# Altium schematic sheet ChannelDriver.SchDoc
size A3
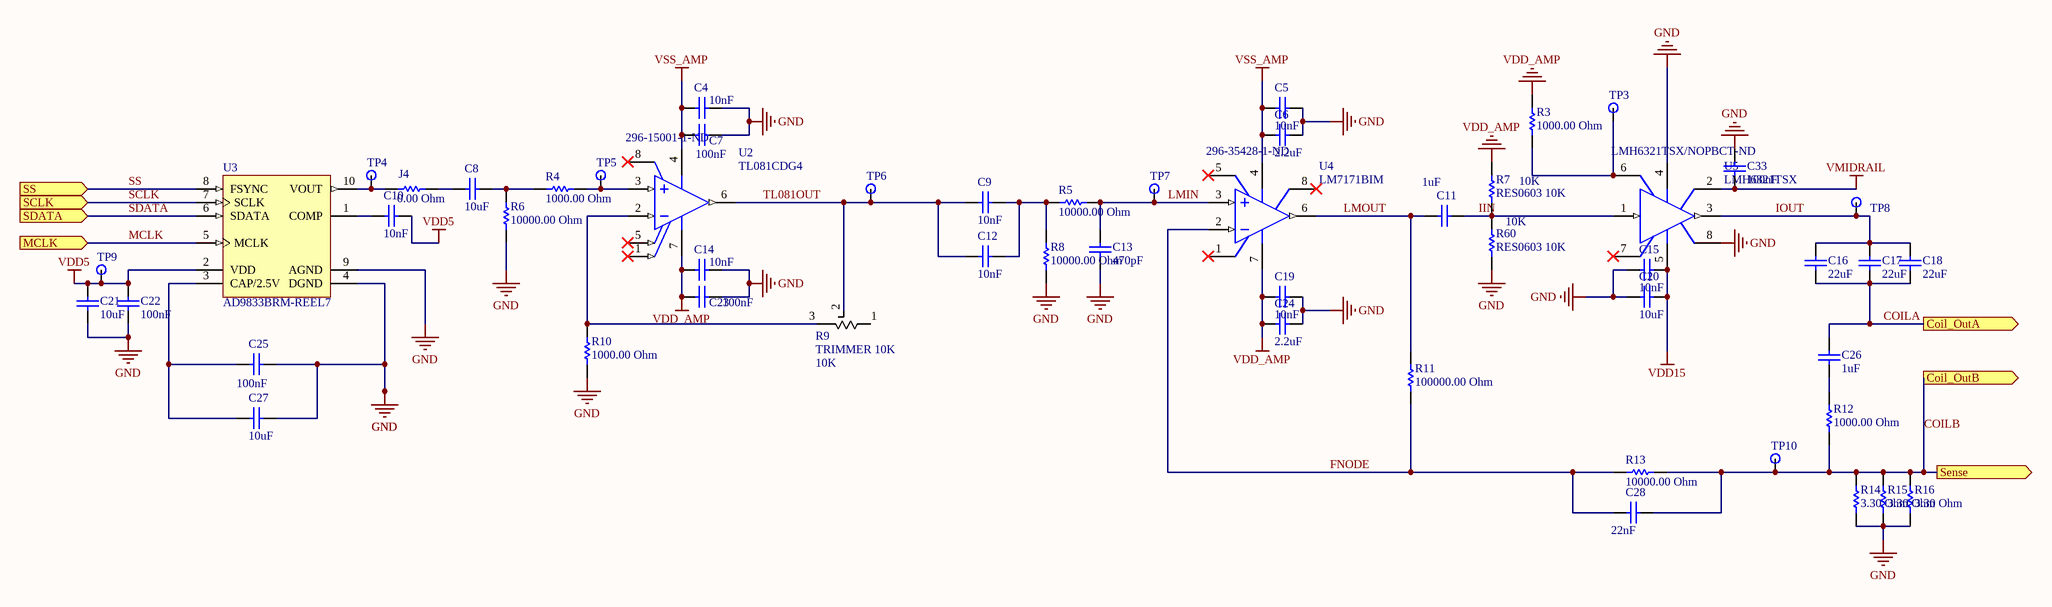
[diagram p0: ChannelDriver.SchDoc]

## Parts
C4  value 10nF  [CAPC0603(1608)100_N]  (hidden comment: CAP 10nF 25V 0603(1608))
C5  value 10nF  [CAPC0603(1608)100_N]  (hidden comment: CAP 10nF 25V 0603(1608))
C6  value 2.2uF  [CAPC0603(1608)100_M]  (hidden comment: CAP 2.2uF 25V 0603(1608))
C7  value 100nF  [CAPC0603(1608)100_M]  (hidden comment: CAP 100nF 25V 0603(1608))
C8  value 10uF  [CAPC1206(3216)190_L]  (hidden comment: CAP 10uF 25V 1206(3216))
C9  value 10nF  [CAPC0603(1608)100_N]  (hidden comment: CAP 10nF 25V 0603(1608))
C10  value 10nF  [CAPC0603(1608)100_N]  (hidden comment: CAP 10nF 25V 0603(1608))
C11  value 1uF  [CAPC0603(1608)100_L]  (hidden comment: CAP 1uF 25V 0603(1608))
C12  value 10nF  [CAPC0603(1608)100_N]  (hidden comment: CAP 10nF 25V 0603(1608))
C13  value 470pF  [CAPC0603(1608)100_N]  (hidden comment: CAP 470pF 25V 0603(1608))
C14  value 10nF  [CAPC0603(1608)100_N]  (hidden comment: CAP 10nF 25V 0603(1608))
C15  value 10nF  [CAPC0603(1608)100_N]  (hidden comment: CAP 10nF 25V 0603(1608))
C16  value 22uF  [CAPC1206(3216)190_M]  (hidden comment: CAP 22uF 25V 1206(3216))
C17  value 22uF  [CAPC1206(3216)190_M]  (hidden comment: CAP 22uF 25V 1206(3216))
C18  value 22uF  [CAPC1206(3216)190_M]  (hidden comment: CAP 22uF 25V 1206(3216))
C19  value 10nF  [CAPC0603(1608)100_N]  (hidden comment: CAP 10nF 25V 0603(1608))
C20  value 10uF  [CAPC1206(3216)190_L]  (hidden comment: CAP 10uF 25V 1206(3216))
C21  value 10uF  [CAPC1206(3216)190_L]  (hidden comment: CAP 10uF 25V 1206(3216))
C22  value 100nF  [CAPC0603(1608)100_M]  (hidden comment: CAP 100nF 25V 0603(1608))
C23  value 100nF  [CAPC0603(1608)100_M]  (hidden comment: CAP 100nF 25V 0603(1608))
C24  value 2.2uF  [CAPC0603(1608)100_M]  (hidden comment: CAP 2.2uF 25V 0603(1608))
C25  value 100nF  [CAPC0603(1608)100_M]  (hidden comment: CAP 100nF 25V 0603(1608))
C26  value 1uF  [CAPC0603(1608)100_L]  (hidden comment: CAP 1uF 25V 0603(1608))
C27  value 10uF  [CAPC1206(3216)190_L]  (hidden comment: CAP 10uF 25V 1206(3216))
C28  value 22nF  [CAPC0603(1608)100_N]  (hidden comment: CAP 22nF 25V 0603(1608))
C33  value 100nF  [CAPC0603(1608)100_M]  (hidden comment: CAP 100nF 25V 0603(1608))
J4  0.00 Ohm  [RESC1206(3216)_M]
R3  value 1000.00 Ohm  [RESC0603(1608)_L]  (hidden comment: 1K 5% 0603(1608))
R4  value 1000.00 Ohm  [RESC0603(1608)_L]  (hidden comment: 1K 5% 0603(1608))
R5  value 10000.00 Ohm  [RESC0603(1608)_N]  (hidden comment: 10K 5% 0603(1608))
R6  value 10000.00 Ohm  [RESC0603(1608)_N]  (hidden comment: 10K 5% 0603(1608))
R7  RES0603 10K  value 10K  [RESC0603(1608)_L]
R8  value 10000.00 Ohm  [RESC0603(1608)_N]  (hidden comment: 10K 5% 0603(1608))
R9  TRIMMER 10K  value 10K  [TRIMMER 10K]
R10  value 1000.00 Ohm  [RESC0603(1608)_L]  (hidden comment: 1K 5% 0603(1608))
R11  value 100000.00 Ohm  [RESC0603(1608)_N]  (hidden comment: 100K 5% 0603(1608))
R12  value 1000.00 Ohm  [RESC0603(1608)_L]  (hidden comment: 1K 5% 0603(1608))
R13  value 10000.00 Ohm  [RESC0603(1608)_N]  (hidden comment: 10K 5% 0603(1608))
R14  3.30 Ohm  [RESC1206(3216)_N]
R15  3.30 Ohm  [RESC1206(3216)_N]
R16  3.30 Ohm  [RESC1206(3216)_N]
R60  RES0603 10K  value 10K  [RESC0603(1608)_L]
TP3  Testpoint  [0603 PROBE PAD]  (value not drawn)
TP4  Testpoint  [0603 PROBE PAD]  (value not drawn)
TP5  Testpoint  [0603 PROBE PAD]  (value not drawn)
TP6  Testpoint  [0603 PROBE PAD]  (value not drawn)
TP7  Testpoint  [0603 PROBE PAD]  (value not drawn)
TP8  Testpoint  [0603 PROBE PAD]  (value not drawn)
TP9  Testpoint  [0603 PROBE PAD]  (value not drawn)
TP10  Testpoint  [0603 PROBE PAD]  (value not drawn)
U2  TL081CDG4  Supplier Part Number 1: 296-15001-1-ND  [TI-D8_N]
U3  AD9833BRM-REEL7  [ADI-RM-10_L]
U4  LM7171BIM  Supplier Part Number 1: 296-35428-1-ND  [D0008A_L]
U5  LMH6321TSX  Supplier Part Number 1: LMH6321TSX/NOPBCT-ND  [TS7B_N]

## Ports
Coil_OutA (out), Coil_OutB (out), MCLK (in), SCLK (in), SDATA (in), Sense (out), SS (in)

## Nets
GND: C4.2 C5.2 C6.2 C7.1 C13.1 C14.2 C15.1 C19.2 C20.2 C21.1 C22.2 C23.1 C24.2 C25.1 C27.1 C33.1 R6.2 R8.2 R10.2 R14.1 R15.1 R16.1 R60.1 U3.4(DGND) U3.9(AGND) U5.4(V-) U5.8(TAB)
VDD5: C10.2 C21.2 C22.1 TP9.0 U3.2(VDD)
VDD15: C15.2 C20.1 U5.5(V+)
VDD_AMP: C14.1 C19.1 C23.2 C24.1 R3.1 R7.2 U2.7(VCC+) U4.7(V+)
VMIDRAIL: C33.2 U5.2(GND)
VSS_AMP: C4.1 C5.1 C6.1 C7.2 U2.4(VCC-) U4.4(V-)
COILA: C16.2 C17.2 C18.2 C26.2 ; port Coil_OutA
COILB: C28.2 R12.2 R13.1 R14.2 R15.2 R16.2 TP10.0 ; port Coil_OutB, port Sense
FNODE: C28.1 R11.2 R13.2 U4.2(IN-)
IIN: C11.2 R7.1 R60.2 U5.1(IN)
IOUT: C16.1 C17.1 C18.1 TP8.0 U5.3(OUT)
LMIN: C13.2 R5.1 TP7.0 U4.3(IN+)
LMOUT: C11.1 R11.1 U4.6(OUT)
MCLK: U3.5(MCLK) ; port MCLK
SCLK: U3.7(SCLK) ; port SCLK
SDATA: U3.6(SDATA) ; port SDATA
SS: U3.8(FSYNC) ; port SS
TL081OUT: C9.1 C12.1 R9.2 TP6.0 U2.6(OUT)
NetC8_1: C8.1 R4.2 R6.1
NetC8_2: C8.2 J4.2
NetC9_2: C9.2 C12.2 R5.2 R8.1
NetC10_1: C10.1 U3.1(COMP)
NetC25_2: C25.2 C27.2 U3.3(CAP/2.5V)
NetC26_1: C26.1 R12.1
NetJ4_1: J4.1 TP4.0 U3.10(VOUT)
NetR3_2: R3.2 TP3.0 U5.6(EF)
NetR4_1: R4.1 TP5.0 U2.3(IN+)
NetR9_3: R9.3 R10.1 U2.2(IN-)

Not connected (* = marked no-connect by the designer): R9 1; U2 1(OFFSET_N1)* 5(OFFSET_N2)* 8(NC)*; U4 1(NC)* 5(NC)* 8(NC)*; U5 7(CL)*

## Library data of the parts
C4 C5 C9 C10 C12 C14 C15 C19 = CMP-1035-02317-1: CAP 10nF 25V ±10% 0603 (1608 Metric) Thickness 1mm SMD; Tolerance: Â±10%; Case-Metric: 1608; Case-EIA: 0603; Max Thickness: 1 mm; Rated Voltage: 25 V; Technology: SMT; OrderURL: http://www.digikey.ie/product-detail/en/yageo/CC0603KRX7R8BB103/311-1360-1-ND/2103144; Supplier 1: Digi-Key; Supplier Part Number 1: 311-1360-1-ND
C6 C24 = CMP-1035-02767-1: CAP 2.2uF 25V ±10% 0603 (1608 Metric) Thickness 1mm SMD; Manufacturer: Taiyo Yuden; Manufacturer Part Number: TMK107ABJ225KA-T; Case-EIA: 0603; Tolerance: Â±10%; Case-Metric: 1608; Capacitance: 2.2µF; Temperature Coefficient: X5R; Technology: SMT; Max Thickness: 1 mm; Rated Voltage: 25 V; OrderURL: http://www.digikey.ie/product-detail/en/taiyo-yuden/TMK107ABJ225KA-T/587-2909-1-ND/2649029; Supplier 1: Digi-Key; Supplier Part Number 1: 587-2909-1-ND; RoHS: RoHS Compliant; Category: Capacitors; Stock 1: 107583; Pricing 1: 1=0.16, 10=0.112, 25=0.0816, 50=0.0632, 100=0.0525, 250=0.04344, 500=0.03678, 1000=0.03045 (EUR); Packaging: Cut Tape (CT); Part Status: Active; Voltage - Rated: 25V; Operating Temperature: -55°C ~ 85°C; Features: -; Ratings: -; Applications: General Purpose; Mounting Type: Surface Mount, MLCC; Package / Case: 0603 (1608 Metric); Size / Dimension: 0.063" L x 0.031" W (1.60mm x 0.80mm); Height - Seated (Max): -; Thickness (Max): 0.035" (0.90mm); Lead Spacing: -; Lead Style: -; ComponentLink1URL: http://ds.yuden.co.jp/TYCOMPAS/ut/detail.do?productNo=TMK107ABJ225KA-T&fileName=TMK107ABJ225KA-T_SS&mode=specSheetDownload; ComponentLink1Description: http://ds.yuden.co.jp/TYCOMPAS/ut/detail.do?productNo=TMK107ABJ225KA-T&fileName=TMK107ABJ225KA-T_SS&mode=specSheetDownload
C7 C22 C23 C25 C33 = CMP-1035-02588-1: CAP 100nF 25V ±10% 0603 (1608 Metric) Thickness 1mm SMD; Case-Metric: 1608; Case-EIA: 0603; Tolerance: Â±10%; Max Thickness: 1 mm; Technology: SMT; Rated Voltage: 25 V; OrderURL: http://www.digikey.ie/product-detail/en/yageo/CC0603KRX7R8BB104/311-1341-1-ND/2103125; Supplier 1: Digi-Key; Supplier Part Number 1: 311-1341-1-ND
C8 C20 C21 C27 = CMP-1037-04979-1: CAP 10uF 25V ±10% 1206 (3216 Metric) Thickness 1.9mm SMD; Case-EIA: 1206; Tolerance: Â±10%; Case-Metric: 3216; Rated Voltage: 25 V; Technology: SMT; Max Thickness: 1.9 mm; OrderURL: http://www.digikey.ie/product-detail/en/murata-electronics-north-america/GRM319R61E106KA12D/490-5525-1-ND/2334921; Supplier 1: Digi-Key; Supplier Part Number 1: 490-5525-1-ND
C11 C26 = CMP-1035-02740-1: CAP 1uF 25V ±10% 0603 (1608 Metric) Thickness 1mm SMD; Tolerance: Â±10%; Case-Metric: 1608; Case-EIA: 0603; Technology: SMT; Rated Voltage: 25 V; Max Thickness: 1 mm; OrderURL: http://www.digikey.ie/product-detail/en/taiyo-yuden/TMK107BJ105KA-T/587-1248-1-ND/931025; Supplier Part Number 1: 587-1248-1-ND; Supplier 1: Digi-Key
C13 = CMP-1035-01671-1: CAP 470pF 25V ±10% 0603 (1608 Metric) Thickness 1mm SMD; Manufacturer: KEMET; Manufacturer Part Number: C0603C471K3RACTU; Case-EIA: 0603; Tolerance: Â±10%; Case-Metric: 1608; Temperature Coefficient: X7R; Technology: SMT; Max Thickness: 1 mm; Rated Voltage: 25 V; OrderURL: http://www.digikey.ie/product-detail/en/kemet/C0603C471K3RACTU/399-9086-1-ND/3522603; Supplier 1: Digi-Key; Supplier Part Number 1: 399-9086-1-ND; RoHS: RoHS Compliant; Category: Capacitors; Stock 1: 50558; Pricing 1: 1=0.09, 10=0.044, 25=0.032, 50=0.024, 100=0.0196, 250=0.01644, 500=0.01402, 1000=0.01102 (EUR); Packaging: Cut Tape (CT); Part Status: Active; Capacitance: 470pF; Voltage - Rated: 25V; Operating Temperature: -55°C ~ 125°C; Features: -; Ratings: -; Applications: General Purpose; Failure Rate: -; Mounting Type: Surface Mount, MLCC; Package / Case: 0603 (1608 Metric); Size / Dimension: 0.063" L x 0.031" W (1.60mm x 0.80mm); Height - Seated (Max): -; Thickness (Max): 0.034" (0.87mm); Lead Spacing: -; Lead Style: -; ComponentLink1URL: http://www.kemet.com/docfinder?Partnumber=C0603C471K3RACTU; ComponentLink1Description: http://www.kemet.com/docfinder?Partnumber=C0603C471K3RACTU
C16-C18 = CMP-1037-04995-1: CAP 22uF 25V ±20% 1206 (3216 Metric) Thickness 1.9mm SMD; Case-EIA: 1206; Tolerance: Â±20%; Case-Metric: 3216; Rated Voltage: 25 V; Technology: SMT; Max Thickness: 1.9 mm; OrderURL: http://www.digikey.ie/product-detail/en/taiyo-yuden/TMK316BBJ226ML-T/587-3246-1-ND/3660105; Supplier Part Number 1: 587-3246-1-ND; Supplier 1: Digi-Key
C28 = CMP-1035-02317-1: CAP 10nF 25V ±10% 0603 (1608 Metric) Thickness 1mm SMD; Manufacturer: Taiyo Yuden; Manufacturer Part Number: TMK107B7223KA-T; Tolerance: Â±10%; Case-Metric: 1608; Case-EIA: 0603; Temperature Coefficient: X7R; Max Thickness: 1 mm; Rated Voltage: 25 V; Technology: SMT; OrderURL: http://www.digikey.ie/product-detail/en/yageo/CC0603KRX7R8BB103/311-1360-1-ND/2103144; Supplier 1: Digi-Key; Supplier Part Number 1: 587-1238-1-ND; RoHS: RoHS Compliant; Category: Capacitors; Stock 1: 40253; Pricing 1: 1=0.08, 10=0.052, 100=0.0232, 500=0.01652, 1000=0.01299 (EUR); Packaging: Cut Tape (CT); Part Status: Active; Voltage - Rated: 25V; Operating Temperature: -55°C ~ 125°C; Features: -; Ratings: -; Applications: General Purpose; Mounting Type: Surface Mount, MLCC; Package / Case: 0603 (1608 Metric); Size / Dimension: 0.063" L x 0.032" W (1.60mm x 0.80mm); Height - Seated (Max): -; Thickness (Max): 0.035" (0.90mm); Lead Spacing: -; Lead Style: -; ComponentLink1URL: http://www.yuden.co.jp/productdata/catalog/en/mlcc_all_e.pdf; ComponentLink1Description: http://www.yuden.co.jp/productdata/catalog/en/mlcc_all_e.pdf
J4 = CMP-1014-00001-1: Jumper 1206 (3216 Metric); Tolerance: None; Case-EIA: 1206; Case-Metric: 3216; Technology: SMT; Power: None; Value: 0.00 Ohm; OrderURL: http://www.digikey.ie/product-detail/en/yageo/RC0603JR-070RL/311-0.0GRCT-ND/729622; Supplier 1: Digi-Key; Supplier Part Number 1: 311-0.0GRCT-ND
R3 R4 R10 R12 = CMP-1012-00074-1: 1K 0.1W 5% 0603 (1608 Metric)  SMD; Case-EIA: 0603; Case-Metric: 1608; Technology: SMT; Tolerance: 5 %; Power: 0.1 W; OrderURL: http://www.digikey.ie/product-detail/en/yageo/RC0603JR-071KL/311-1.0KGRCT-ND/729624; Supplier 1: Digi-Key; Supplier Part Number 1: 311-1.0KGRCT-ND
R5 R6 R8 R13 = CMP-1012-00098-1: 10K 0.1W 5% 0603 (1608 Metric)  SMD; Case-EIA: 0603; Case-Metric: 1608; Technology: SMT; Tolerance: 5 %; Power: 0.1 W; OrderURL: http://www.digikey.ie/product-detail/en/yageo/RC0603JR-0710KL/311-10KGRCT-ND/729647; Supplier 1: Digi-Key; Supplier Part Number 1: 311-10KGRCT-ND
R7 R60 = CMP-1591-00001-1: 0603 (1608 Metric) Chip Resistor; Manufacturer: Yageo; Manufacturer Part Number: RT0603BRD0710KL; Case-Metric: 1608; Case-EIA: 0603; Power (Watts): 0.1W, 1/10W; Temperature Coefficient: ±25ppm/°C; PackageReference: RESC0603(1608); Supplier 1: Digi-Key; Supplier Part Number 1: YAG1236CT-ND; RoHS: RoHS Compliant; Category: Resistors; Stock 1: 62928; Pricing 1: 1=0.3, 10=0.254, 25=0.1844, 50=0.1336, 100=0.0991, 250=0.07608, 500=0.05994, 1000=0.0415 (EUR); Packaging: Cut Tape (CT); Part Status: Active; Resistance (Ohms): 10k; Composition: Thin Film; Features: Moisture Resistant; Operating Temperature: -55°C ~ 155°C; Package / Case: 0603 (1608 Metric); Supplier Device Package: 0603; Size / Dimension: 0.063" L x 0.031" W (1.60mm x 0.80mm); Height - Seated (Max): 0.022" (0.55mm); Failure Rate: -; ComponentLink1URL: http://www.yageo.com/documents/recent/PYu-RT_1-to-0.01_RoHS_L_7.pdf; ComponentLink1Description: http://www.yageo.com/documents/recent/PYu-RT_1-to-0.01_RoHS_L_7.pdf
R9 = TRIMMER 10K: TRIMMER 10K OHM 0.5W TH; Manufacturer: TE Connectivity Passive Product; Manufacturer Part Number: 1-1623849-0; Power (Watts): 0.5W, 1/2W; Tolerance: ±10%; Temperature Coefficient: ±100ppm/°C; Number of Turns: 25; Adjustment Type: Top Adjustment; Resistive Material: Cermet; Published: 8-Jun-2000; LatestRevisionDate: 29-May-2009; LatestRevisionNote: IPC-7351 Footprint Added.; PackageReference: J1-0603; Publisher: Altium Limited; PackageDescription: Chip Resistor; RoHS: RoHS Compliant; Category: Potentiometers, Variable Resistors; Packaging: Bulk; Part Status: Active; Resistance (Ohms): 10k; Mounting Type: Through Hole; Termination Style: PC Pins; Size / Dimension: Rectangular - 0.374" x 0.185" Face x 0.394" H (9.50mm x 4.70mm x 10.00mm); ComponentLink1URL: http://www.te.com/commerce/DocumentDelivery/DDEController?Action=srchrtrv&DocNm=1623849&DocType=Customer+Drawing&DocLang=English; ComponentLink1Description: http://www.te.com/commerce/DocumentDelivery/DDEController?Action=srchrtrv&DocNm=1623849&DocType=Customer+Drawing&DocLang=English; Supplier 1: Digi-Key; Supplier Part Number 1: A105870-ND; Stock 1: 5809; Pricing 1: 1=0.89, 10=0.786, 25=0.7076, 50=0.6816, 100=0.6554, 250=0.61608, 500=0.5243, 1000=0.48499, 5000=0.39848 (EUR)
R11 = CMP-1012-00122-1: 100K 0.1W 5% 0603 (1608 Metric)  SMD; Case-EIA: 0603; Case-Metric: 1608; Tolerance: 5 %; Power: 0.1 W; Technology: SMT; OrderURL: http://www.digikey.ie/product-detail/en/yageo/RC0603JR-07100KL/311-100KGRCT-ND/729645; Supplier Part Number 1: 311-100KGRCT-ND; Supplier 1: Digi-Key
R14-R16 = CMP-1014-00014-1: 3R3 0.25W 5% 1206 (3216 Metric)  SMD; Manufacturer: Yageo; Manufacturer Part Number: RC0603FR-073R32L; Case-EIA: 1206; Case-Metric: 3216; Resistance (Ohms): 3.32; Power (Watts): 0.1W, 1/10W; Temperature Coefficient: ±200ppm/°C; Power: 0.25 W; Tolerance: 5 %; Technology: SMT; Value: 3.30 Ohm; Supplier 1: Digi-Key; Supplier Part Number 1: 311-3.32HRCT-ND; RoHS: RoHS Compliant; Category: Resistors; Stock 1: 33932; Pricing 1: 1=0.09, 10=0.018, 25=0.0132, 50=0.0098, 100=0.0073, 250=0.0056, 500=0.00446, 1000=0.00329 (EUR); Packaging: Cut Tape (CT); Part Status: Active; Composition: Thick Film; Features: Moisture Resistant; Operating Temperature: -55°C ~ 155°C; Package / Case: 0603 (1608 Metric); Supplier Device Package: 0603; Size / Dimension: 0.063" L x 0.031" W (1.60mm x 0.80mm); Height - Seated (Max): 0.022" (0.55mm); Number of Terminations: 2; Failure Rate: -; ComponentLink1URL: http://www.yageo.com/documents/recent/PYu-RC_Group_51_RoHS_L_6.pdf; ComponentLink1Description: http://www.yageo.com/documents/recent/PYu-RC_Group_51_RoHS_L_6.pdf
TP3-TP10 = Testpoint: 0.063" x 0.031" x 0.045" (1.60mm x 0.80mm x 1.15mm); OrderURL: http://www.digikey.ie/product-detail/en/te-connectivity-amp-connectors/RCU-0C/A106145CT-ND/3477802; Value: *; Width: 0.8; Height: 1.15mm; Length: 1.60mm; Supplier Part Number 1: A106145CT-ND; Supplier 1: Digi-Key
U2 = CMP-0017-00506-1: JFET-Input Operational Amplifier, 7 to 36 V, 0 to 70 degC, 8-pin SOIC (D8), Green (RoHS & no Sb/Br); Manufacturer: Texas Instruments; Manufacturer Part Number: TL081CDR; Total Supply Voltage(Min)(+5V is 5, +/-5V is 10): 7; Rating: Military; CMRR(Min)(dB): 70; IIB(Max)(pA): 400; Iq per channel(Max)(mA): 2.8; Vio (25C)(Max)(mV): 15; Vn at 1kHz(Typ)(nV/rtHz): 18; Slew Rate(Typ)(V/us): 13; Sub Family: General Purpose Amplifier, High Supply Voltage Amplifier (>=30V); Total Supply Voltage(Max)(+5V is 5, +/-5V is 10): 36; Number of Channels: 1; GBW(Typ)(MHz): 3; Amplifier Type: J-FET; Slew Rate: 13 V/µs; Gain Bandwidth Product: 3MHz; Current - Input Bias: 30pA; Voltage - Input Offset: 3mV; Current - Supply: 1.4mA; Voltage - Supply, Single/Dual (±): 7 V ~ 36 V, ±3.5 V ~ 18 V; ComponentLink3Description: Package Specification; Eco-Plan: Green (RoHS & no Sb/Br); PackageReference: D8; ComponentLink1Description: Manufacturer URL; PackageDescription: 8-Pin Plastic Small Outline, Body 4.9 x 3.9 mm, Pitch 1.27 mm; DatasheetVersion: SLOS081G; PackageVersion: 4040047-3/M, 06/2011; Code_JEDEC: MS-012; ComponentLink2URL: http://www.ti.com/lit/ds/symlink/tl081.pdf; ComponentLink1URL: http://www.ti.com/; Offset Drift(Typ)(uV/C): 18; Mounting Technology: Surface Mount; ComponentLink2Description: Datasheet; PartNumber: TL081CDG4; ComponentLink3URL: http://www.ti.com/litv/pdf/msoi002j; OrderURL: http://www.digikey.ie/product-detail/en/texas-instruments/TL081CDR/296-15001-1-ND/562657; Supplier 1: Digi-Key; RoHS: RoHS Compliant; Category: Integrated Circuits (ICs); Stock 1: 9909; Pricing 1: 1=0.44, 10=0.375, 100=0.28, 500=0.22002, 1000=0.17001 (EUR); Packaging: Cut Tape (CT); Part Status: Active; Number of Circuits: 1; Output Type: -; -3db Bandwidth: -; Current - Output / Channel: -; Operating Temperature: 0°C ~ 70°C; Mounting Type: Surface Mount; Package / Case: 8-SOIC (0.154", 3.90mm Width); Supplier Device Package: 8-SOIC; ComponentLink4URL: http://www.ti.com/lit/ds/symlink/tl081a.pdf; ComponentLink4Description: http://www.ti.com/lit/ds/symlink/tl081a.pdf
U3 = CMP-0293-00080-1: Low Power, 12.65 mW, 2.3 V to 5.5 V, Programmable Waveform Generator, 10-Bit, Serial, RM-10, 1000 Reel; Manufacturer: Analog Devices Inc.; Manufacturer Part Number: AD9833BRMZ-REEL7; Compliance Range (V): 650mV; Master fclk: 25MHz; I Supply total (max): 5.5mA; FS Iout (mA nom): 3mA; Resolution (Bits): 10bit; Tuning Word Width (bits): 28bit; REFCLK Multiplier: No; Voltage - Supply: 2.3 V ~ 5.5 V; ComponentLink2Description: Datasheet; ComponentLink2URL: http://www.analog.com/static/imported-files/data_sheets/AD9833.pdf; PackageReference: RM-10; ComponentLink3Description: Package Specification; DatasheetVersion: Rev. D; ComponentLink1URL: www.analog.com; PackageVersion: 5/8/2005; ComponentLink3URL: http://www.analog.com/static/imported-files/packages/PKG_PDF/MSOP%28RM%29/RM_10.pdf; I/O Interface: Serial; ComponentLink1Description: Manufacturer URL; PackageDescription: 10-Lead Mini Small Outline Package [MSOP]; Code_JEDEC: MO-187-BA; OrderURL: http://www.digikey.ie/product-detail/en/analog-devices-inc/AD9833BRMZ/AD9833BRMZ-ND/751220; Supplier 1: Digi-Key; Supplier Part Number 1: AD9833BRMZ-REEL7CT-ND; RoHS: RoHS Compliant; Category: Integrated Circuits (ICs); Stock 1: 3129; Pricing 1: 1=9.42, 10=8.507, 100=7.0426, 500=6.13264 (EUR); Packaging: Cut Tape (CT); Part Status: Active; Operating Temperature: -40°C ~ 125°C; Mounting Type: Surface Mount; Package / Case: 10-TFSOP, 10-MSOP (0.118", 3.00mm Width); Supplier Device Package: 10-MSOP; ComponentLink4URL: http://www.analog.com/media/en/technical-documentation/data-sheets/AD9833.pdf; ComponentLink4Description: http://www.analog.com/media/en/technical-documentation/data-sheets/AD9833.pdf
U4 = CMP-0055-00670-3: Very High Speed, High Output Current, Voltage Feedback Amplifier, 8-pin Narrow SOIC; Manufacturer: Texas Instruments; Manufacturer Part Number: LM7171AIMX/NOPB; PackageTopMarking: NSZXTT*LM71*71BIM; CompType: Amplifiers; PowerWise: N; Number of Circuits: 1; Slew Rate: 4100 V/µs; Gain Bandwidth Product: 200MHz; -3db Bandwidth: 220MHz; Current - Input Bias: 2.7µA; Voltage - Input Offset: 200µV; Current - Supply: 6.5mA; Current - Output / Channel: 118mA; Voltage - Supply, Single/Dual (±): 5.5 V ~ 36 V, ±2.75 V ~ 18 V; ComponentLink1Description: Datasheet URL; RoHS: N; Package Reference: D0008A; Code_JEDEC: MS-012-AA; Code_IPC: SOIC127P600-8; PinCount: 8; ComponentLink1URL: http://www.ti.com/general/docs/lit/getliterature.tsp?genericPartNumber=LM7171&fileType=pdf; PackageDescription: SOIC Narrow, 4.9 x 3.9 x 1.45mm, 8 Lead, 1.27mm Pitch; OrderURL: http://www.digikey.ie/product-detail/en/texas-instruments/LM7171BIMX-NOPB/LM7171BIMX-NOPBCT-ND/3767451; Supplier 1: Digi-Key; Category: Integrated Circuits (ICs); Stock 1: 3018; Pricing 1: 1=3.07, 10=2.76, 100=2.2615, 500=1.9251, 1000=1.62358 (EUR); Packaging: Cut Tape (CT); Part Status: Active; Amplifier Type: Voltage Feedback; Output Type: -; Operating Temperature: -40°C ~ 85°C; Mounting Type: Surface Mount; Package / Case: 8-SOIC (0.154", 3.90mm Width); Supplier Device Package: 8-SOIC; ComponentLink2URL: http://www.ti.com/lit/ds/symlink/lm7171.pdf; ComponentLink2Description: http://www.ti.com/lit/ds/symlink/lm7171.pdf
U5 = CMP-0055-00076-2: 300 mA High Speed Buffer with Adjustable Current Limit, 7-pin TO-263; Manufacturer: National Semiconductor; Manufacturer Part Number: LMH6321TSX/NOPB; CompType: Amplifiers; PackageTopMarking: NSUZXYTTE#*LMH6321TS; PowerWise: N; Number of Circuits: 1; Slew Rate: 2900 V/µs; -3db Bandwidth: 110MHz; Current - Input Bias: 2µA; Voltage - Input Offset: 4mV; Current - Supply: 14.9mA; Current - Output / Channel: 295mA; Voltage - Supply, Single/Dual (±): 5 V ~ 32 V, ±2.5 V ~ 16 V; ComponentLink2Description: LMH6321 Web Page; RoHS: N; ComponentLink3Description: TS7B Package Page; ComponentLink1URL: http://www.national.com/ds/LM/LMH6321.pdf; ComponentLink1Description: LMH6321 Datasheet; ComponentLink3URL: http://www.national.com/packaging/folders/ts7b.html; PinCount: 7; DatasheetVersion: Apr-2007; PackageReference: TS7B; RevisionNote: Component URLs added; PackageDescription: TO-263, Molded, .400 x .390 x .180in Body, 7 Lead, .050in Pitch, Surface Mount; PackageVersion: revE, Jul-2003; ComponentLink2URL: http://www.national.com/pf/LM/LMH6321.html; Code_JEDEC: MO-169-AC; OrderURL: http://www.digikey.ie/product-detail/en/texas-instruments/LMH6321TS-NOPB/LMH6321TS-NOPB-ND/1117634; Supplier 1: Digi-Key; Category: Integrated Circuits (ICs); Stock 1: 487; Pricing 1: 1=4.79, 10=4.305, 100=3.5271 (EUR); Packaging: Cut Tape (CT); Part Status: Active; Amplifier Type: Buffer; Output Type: -; Gain Bandwidth Product: -; Operating Temperature: -40°C ~ 125°C; Mounting Type: Surface Mount; Package / Case: TO-263-8, D²Pak (7 Leads + Tab), TO-263CA; Supplier Device Package: DDPAK/TO-263-7; ComponentLink4URL: http://www.ti.com/lit/ds/symlink/lmh6321.pdf; ComponentLink4Description: http://www.ti.com/lit/ds/symlink/lmh6321.pdf